# Altium project clock_for_filimonov.PrjPcb
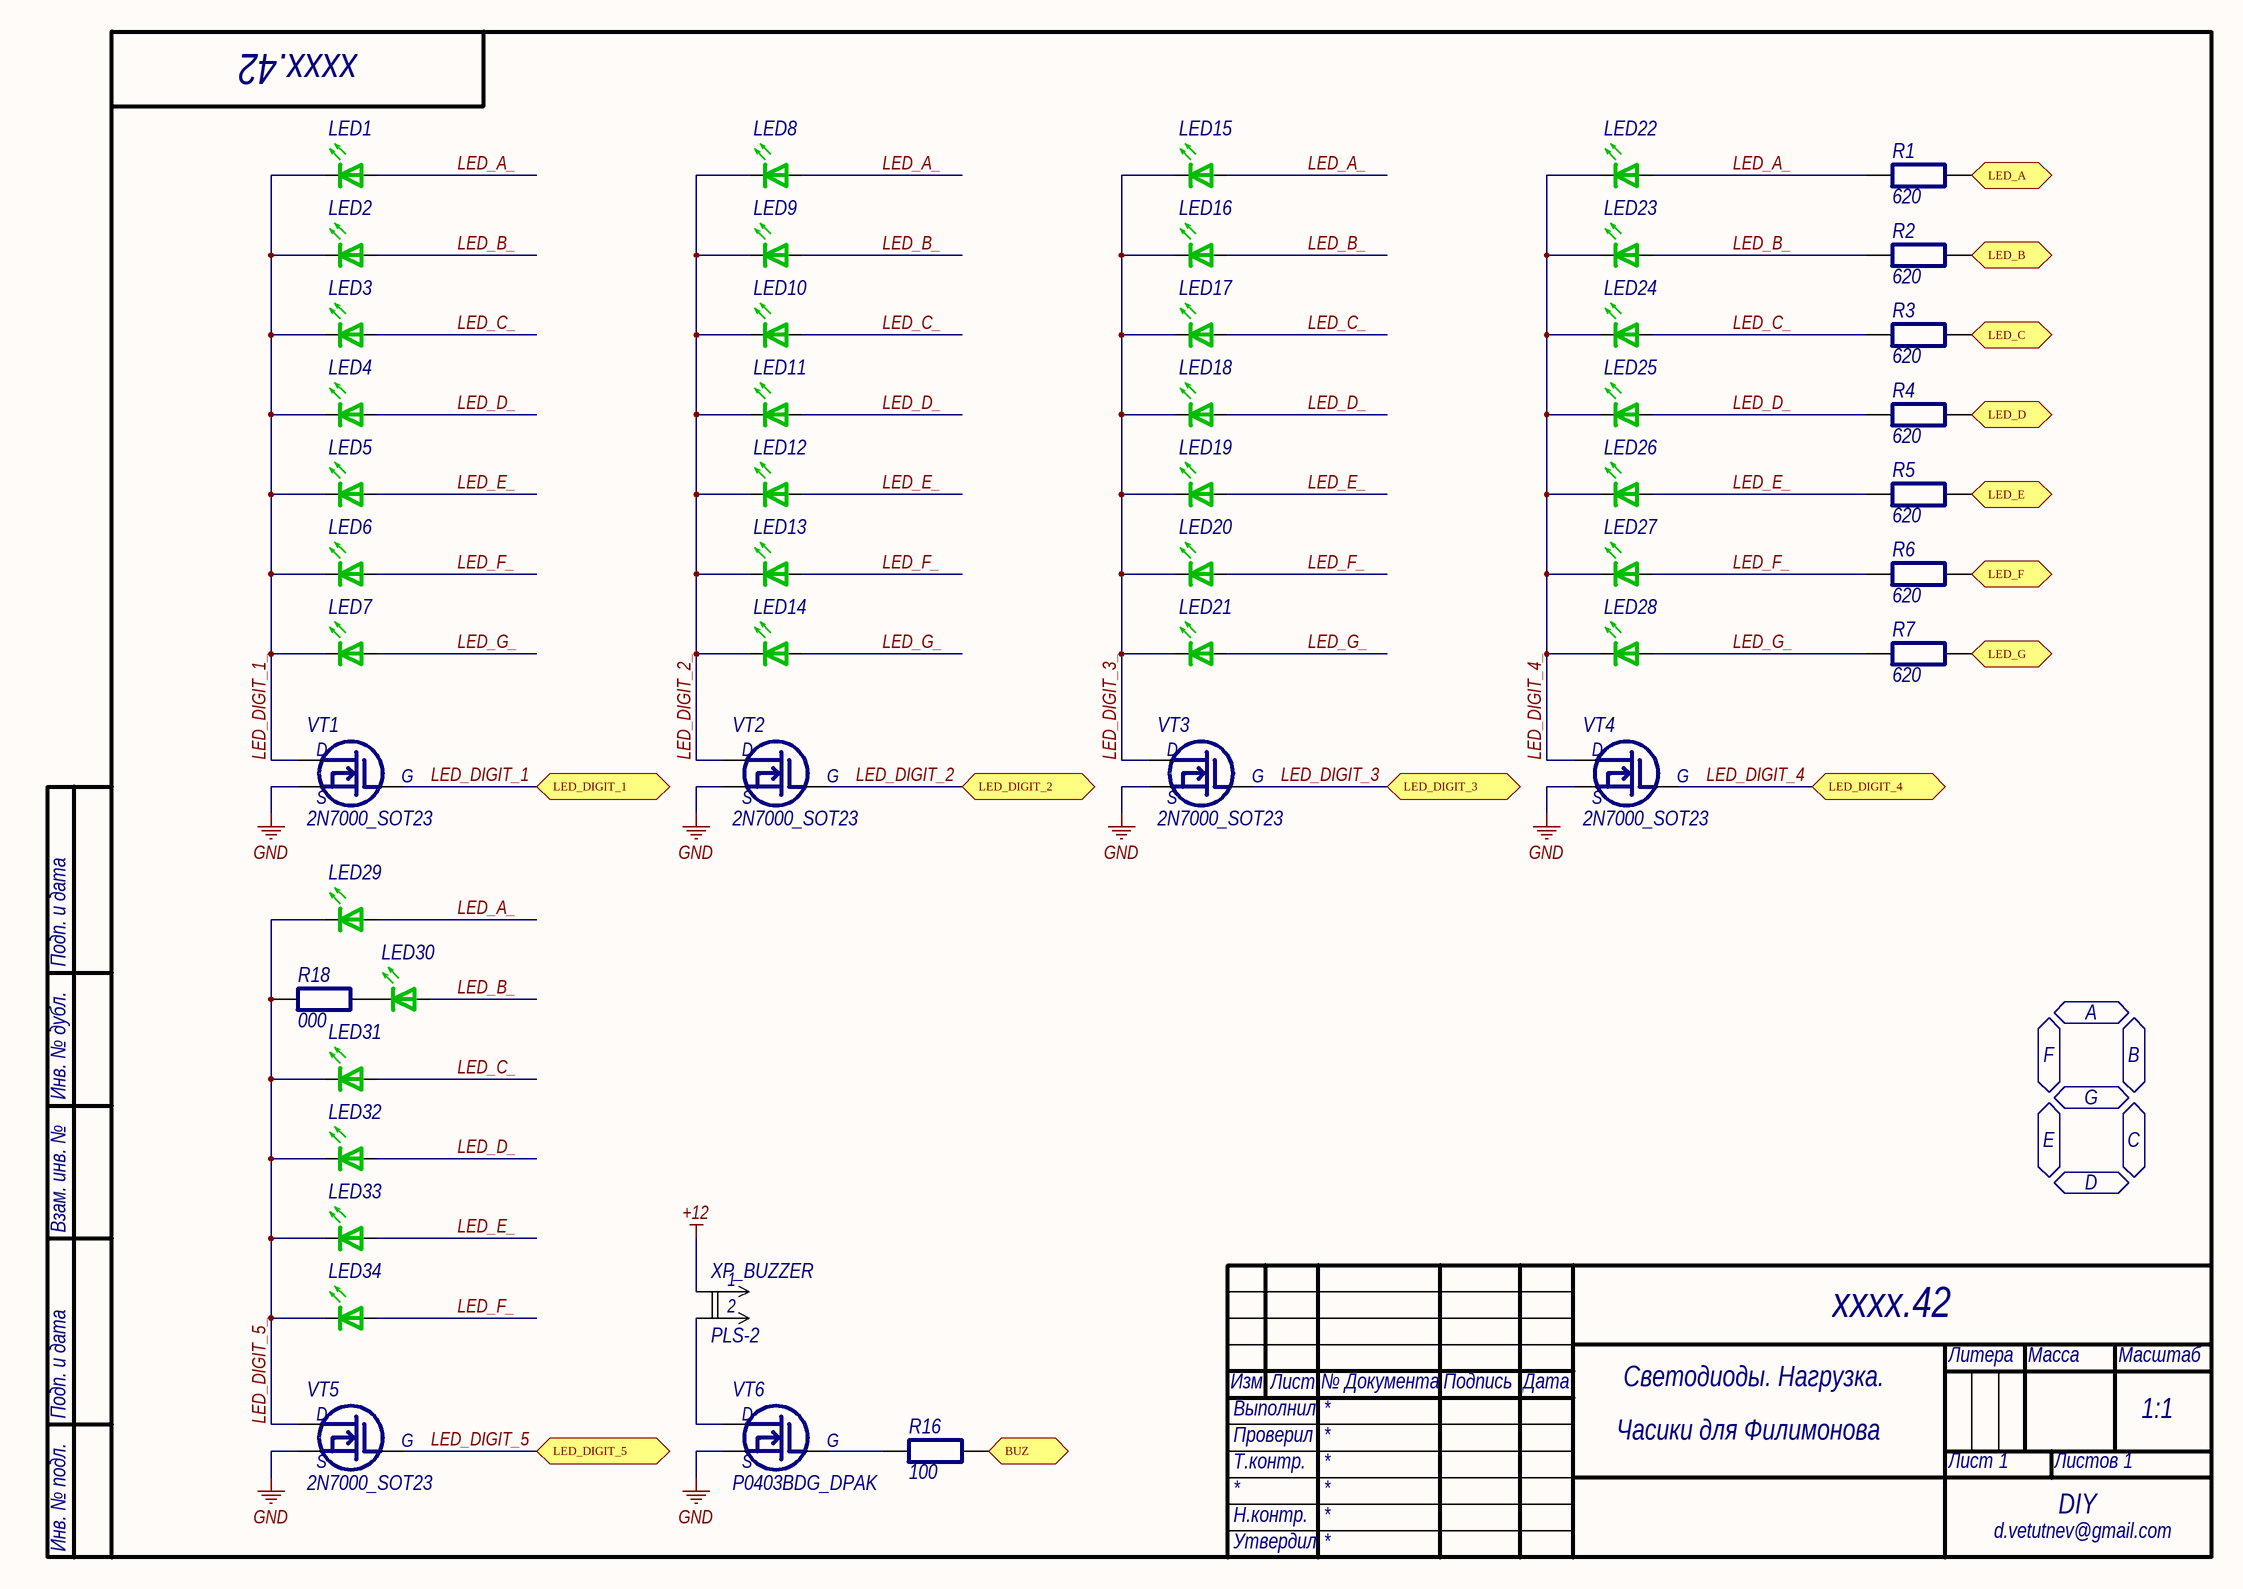
[diagram p0: LED.SchDoc]
Title2str: Часики для Филимонова
2 sheets, 77 parts. Net scope: flat (ports and power ports of the same name join across sheets).
Board file: PCB.PcbDoc
Sheets:
  LED.SchDoc
  PSU.SchDoc

## Sheet LED.SchDoc: Светодиоды. Нагрузка.
size 420 x 297 mm; Organization: DIY; Address1: L3, 12a Rodborough Rd; Address2: Frenchs Forest; Address3: NSW; Address4: Australia 2086; SheetNumber: 1; SheetTotal: 1; PageSetup: Record=PageOptions|CenterHorizontal=False|CenterVertical=False|PrintScale=1.00|XCorrection=1.00|YCorrection=1.00|PrintKind=2|BorderSize=5000000|LeftOffset=0|BottomOffset=0|Orientation=1|PaperLength=1000|PaperWidth=1000|Scale=100|PaperSource=7|PrintQuality=-4|MediaType=1|DitherType=10|PrintScaleMode=0|PaperKind=A4|PaperIndex=9; Document: Схема блока; Title2str: Часики для Филимонова; FirstReference: xxxx.42; Scale: 1:1; Email: d.vetutnev@gmail.com; ProjectName: УСТРОЙСТВО

### Parts
LED1  Green 0805  [CD2012-0805 - Green]  (value not drawn)
LED2  Green 0805  [CD2012-0805 - Green]  (value not drawn)
LED3  Green 0805  [CD2012-0805 - Green]  (value not drawn)
LED4  Green 0805  [CD2012-0805 - Green]  (value not drawn)
LED5  Green 0805  [CD2012-0805 - Green]  (value not drawn)
LED6  Green 0805  [CD2012-0805 - Green]  (value not drawn)
LED7  Green 0805  [CD2012-0805 - Green]  (value not drawn)
LED8  Green 0805  [CD2012-0805 - Green]  (value not drawn)
LED9  Green 0805  [CD2012-0805 - Green]  (value not drawn)
LED10  Green 0805  [CD2012-0805 - Green]  (value not drawn)
LED11  Green 0805  [CD2012-0805 - Green]  (value not drawn)
LED12  Green 0805  [CD2012-0805 - Green]  (value not drawn)
LED13  Green 0805  [CD2012-0805 - Green]  (value not drawn)
LED14  Green 0805  [CD2012-0805 - Green]  (value not drawn)
LED15  Green 0805  [CD2012-0805 - Green]  (value not drawn)
LED16  Green 0805  [CD2012-0805 - Green]  (value not drawn)
LED17  Green 0805  [CD2012-0805 - Green]  (value not drawn)
LED18  Green 0805  [CD2012-0805 - Green]  (value not drawn)
LED19  Green 0805  [CD2012-0805 - Green]  (value not drawn)
LED20  Green 0805  [CD2012-0805 - Green]  (value not drawn)
LED21  Green 0805  [CD2012-0805 - Green]  (value not drawn)
LED22  Green 0805  [CD2012-0805 - Green]  (value not drawn)
LED23  Green 0805  [CD2012-0805 - Green]  (value not drawn)
LED24  Green 0805  [CD2012-0805 - Green]  (value not drawn)
LED25  Green 0805  [CD2012-0805 - Green]  (value not drawn)
LED26  Green 0805  [CD2012-0805 - Green]  (value not drawn)
LED27  Green 0805  [CD2012-0805 - Green]  (value not drawn)
LED28  Green 0805  [CD2012-0805 - Green]  (value not drawn)
LED29  Green 0805  [CD2012-0805 - Green]  (value not drawn)
LED30  Green 0805  [CD2012-0805 - Green]  (value not drawn)
LED31  Green 0805  [CD2012-0805 - Green]  (value not drawn)
LED32  Green 0805  [CD2012-0805 - Green]  (value not drawn)
LED33  Green 0805  [CD2012-0805 - Green]  (value not drawn)
LED34  Green 0805  [CD2012-0805 - Green]  (value not drawn)
R1  620  [RESC2012M]
R2  620  [RESC2012M]
R3  620  [RESC2012M]
R4  620  [RESC2012M]
R5  620  [RESC2012M]
R6  620  [RESC2012M]
R7  620  [RESC2012M]
R16  100  [RESC2012M]
R18  000  [RESC3216M]
VT1  2N7000_SOT23  [SOT23]
VT2  2N7000_SOT23  [SOT23]
VT3  2N7000_SOT23  [SOT23]
VT4  2N7000_SOT23  [SOT23]
VT5  2N7000_SOT23  [SOT23]
VT6  P0403BDG_DPAK  [DPAK(TO252)]
XP_BUZZER  PLS-2  [PLS-2]

### Ports
BUZ, LED_A, LED_B, LED_C, LED_D, LED_DIGIT_1, LED_DIGIT_2, LED_DIGIT_3, LED_DIGIT_4, LED_DIGIT_5, LED_E, LED_F, LED_G

### Nets
+12: XP_BUZZER.1
GND: VT1.2(S) VT2.2(S) VT3.2(S) VT4.2(S) VT5.2(S) VT6.3(S)
BUZ: R16.2 ; port BUZ
LED_A: R1.2 ; port LED_A
LED_A_: LED1.1 LED8.1 LED15.1 LED22.1 LED29.1 R1.1
LED_B: R2.2 ; port LED_B
LED_B_: LED2.1 LED9.1 LED16.1 LED23.1 LED30.1 R2.1
LED_C: R3.2 ; port LED_C
LED_C_: LED3.1 LED10.1 LED17.1 LED24.1 LED31.1 R3.1
LED_D: R4.2 ; port LED_D
LED_D_: LED4.1 LED11.1 LED18.1 LED25.1 LED32.1 R4.1
LED_DIGIT_1: VT1.1(G) ; port LED_DIGIT_1
LED_DIGIT_1_: LED1.2 LED2.2 LED3.2 LED4.2 LED5.2 LED6.2 LED7.2 VT1.3(D)
LED_DIGIT_2: VT2.1(G) ; port LED_DIGIT_2
LED_DIGIT_2_: LED8.2 LED9.2 LED10.2 LED11.2 LED12.2 LED13.2 LED14.2 VT2.3(D)
LED_DIGIT_3: VT3.1(G) ; port LED_DIGIT_3  [project net ISP_MISO]
LED_DIGIT_3_: LED15.2 LED16.2 LED17.2 LED18.2 LED19.2 LED20.2 LED21.2 VT3.3(D)
LED_DIGIT_4: VT4.1(G) ; port LED_DIGIT_4  [project net ISP_MOSI]
LED_DIGIT_4_: LED22.2 LED23.2 LED24.2 LED25.2 LED26.2 LED27.2 LED28.2 VT4.3(D)
LED_DIGIT_5: VT5.1(G) ; port LED_DIGIT_5
LED_DIGIT_5_: LED29.2 LED31.2 LED32.2 LED33.2 LED34.2 R18.1 VT5.3(D)
LED_E: R5.2 ; port LED_E
LED_E_: LED5.1 LED12.1 LED19.1 LED26.1 LED33.1 R5.1
LED_F: R6.2 ; port LED_F
LED_F_: LED6.1 LED13.1 LED20.1 LED27.1 LED34.1 R6.1
LED_G: R7.2 ; port LED_G
LED_G_: LED7.1 LED14.1 LED21.1 LED28.1 R7.1
NetLED30_2: LED30.2 R18.2
NetR16_1: R16.1 VT6.1(G)
NetVT6_4: VT6.4(D) XP_BUZZER.2

### Notes on the sheet
- F
- A
- B
- E
- G
- C
- D
- Подп. и дата
- Инв. № дубл.
- Взам. инв. №
- Изм
- Выполнил
- Лист
- № Документа
- Подпись
- Дата
- Литера
- Масса
- Масштаб
- Проверил
- Т.контр.
- Листов
- Н.контр.
- Утвердил
- Инв. № подл.

### Library data of the parts
LED1-LED34 = LED_Green_0805: PartNumber: Green 0805
R1-R7 R16 = Res_0805: PartNumber: SMD 0805
  R1-R7: Value: 620
  R16: Value: 100
R18 = Res_1206: PartNumber: SMD 1206; Value: 000
VT1-VT5 = 2N7000_SOT23: PartNumber: 2N7000_SOT23
VT6 = P0403BDG_DPAK: PartNumber: P0403BDG_DPAK
XP_BUZZER = PLS-2: PartNumber: PLS-2

## Sheet PSU.SchDoc: МК. БП.
size 420 x 297 mm; Organization: DIY; Address1: L3, 12a Rodborough Rd; Address2: Frenchs Forest; Address3: NSW; Address4: Australia 2086; SheetNumber: 1; SheetTotal: 1; PageSetup: Record=PageOptions|CenterHorizontal=False|CenterVertical=False|PrintScale=1.00|XCorrection=1.00|YCorrection=1.00|PrintKind=2|BorderSize=5000000|LeftOffset=0|BottomOffset=0|Orientation=1|PaperLength=1000|PaperWidth=1000|Scale=100|PaperSource=7|PrintQuality=-4|MediaType=1|DitherType=10|PrintScaleMode=0|PaperKind=A4|PaperIndex=9; Document: Схема блока; Title2str: Часики для Филимонова; FirstReference: xxxx.42; Scale: 1:1; Email: d.vetutnev@gmail.com; ProjectName: УСТРОЙСТВО
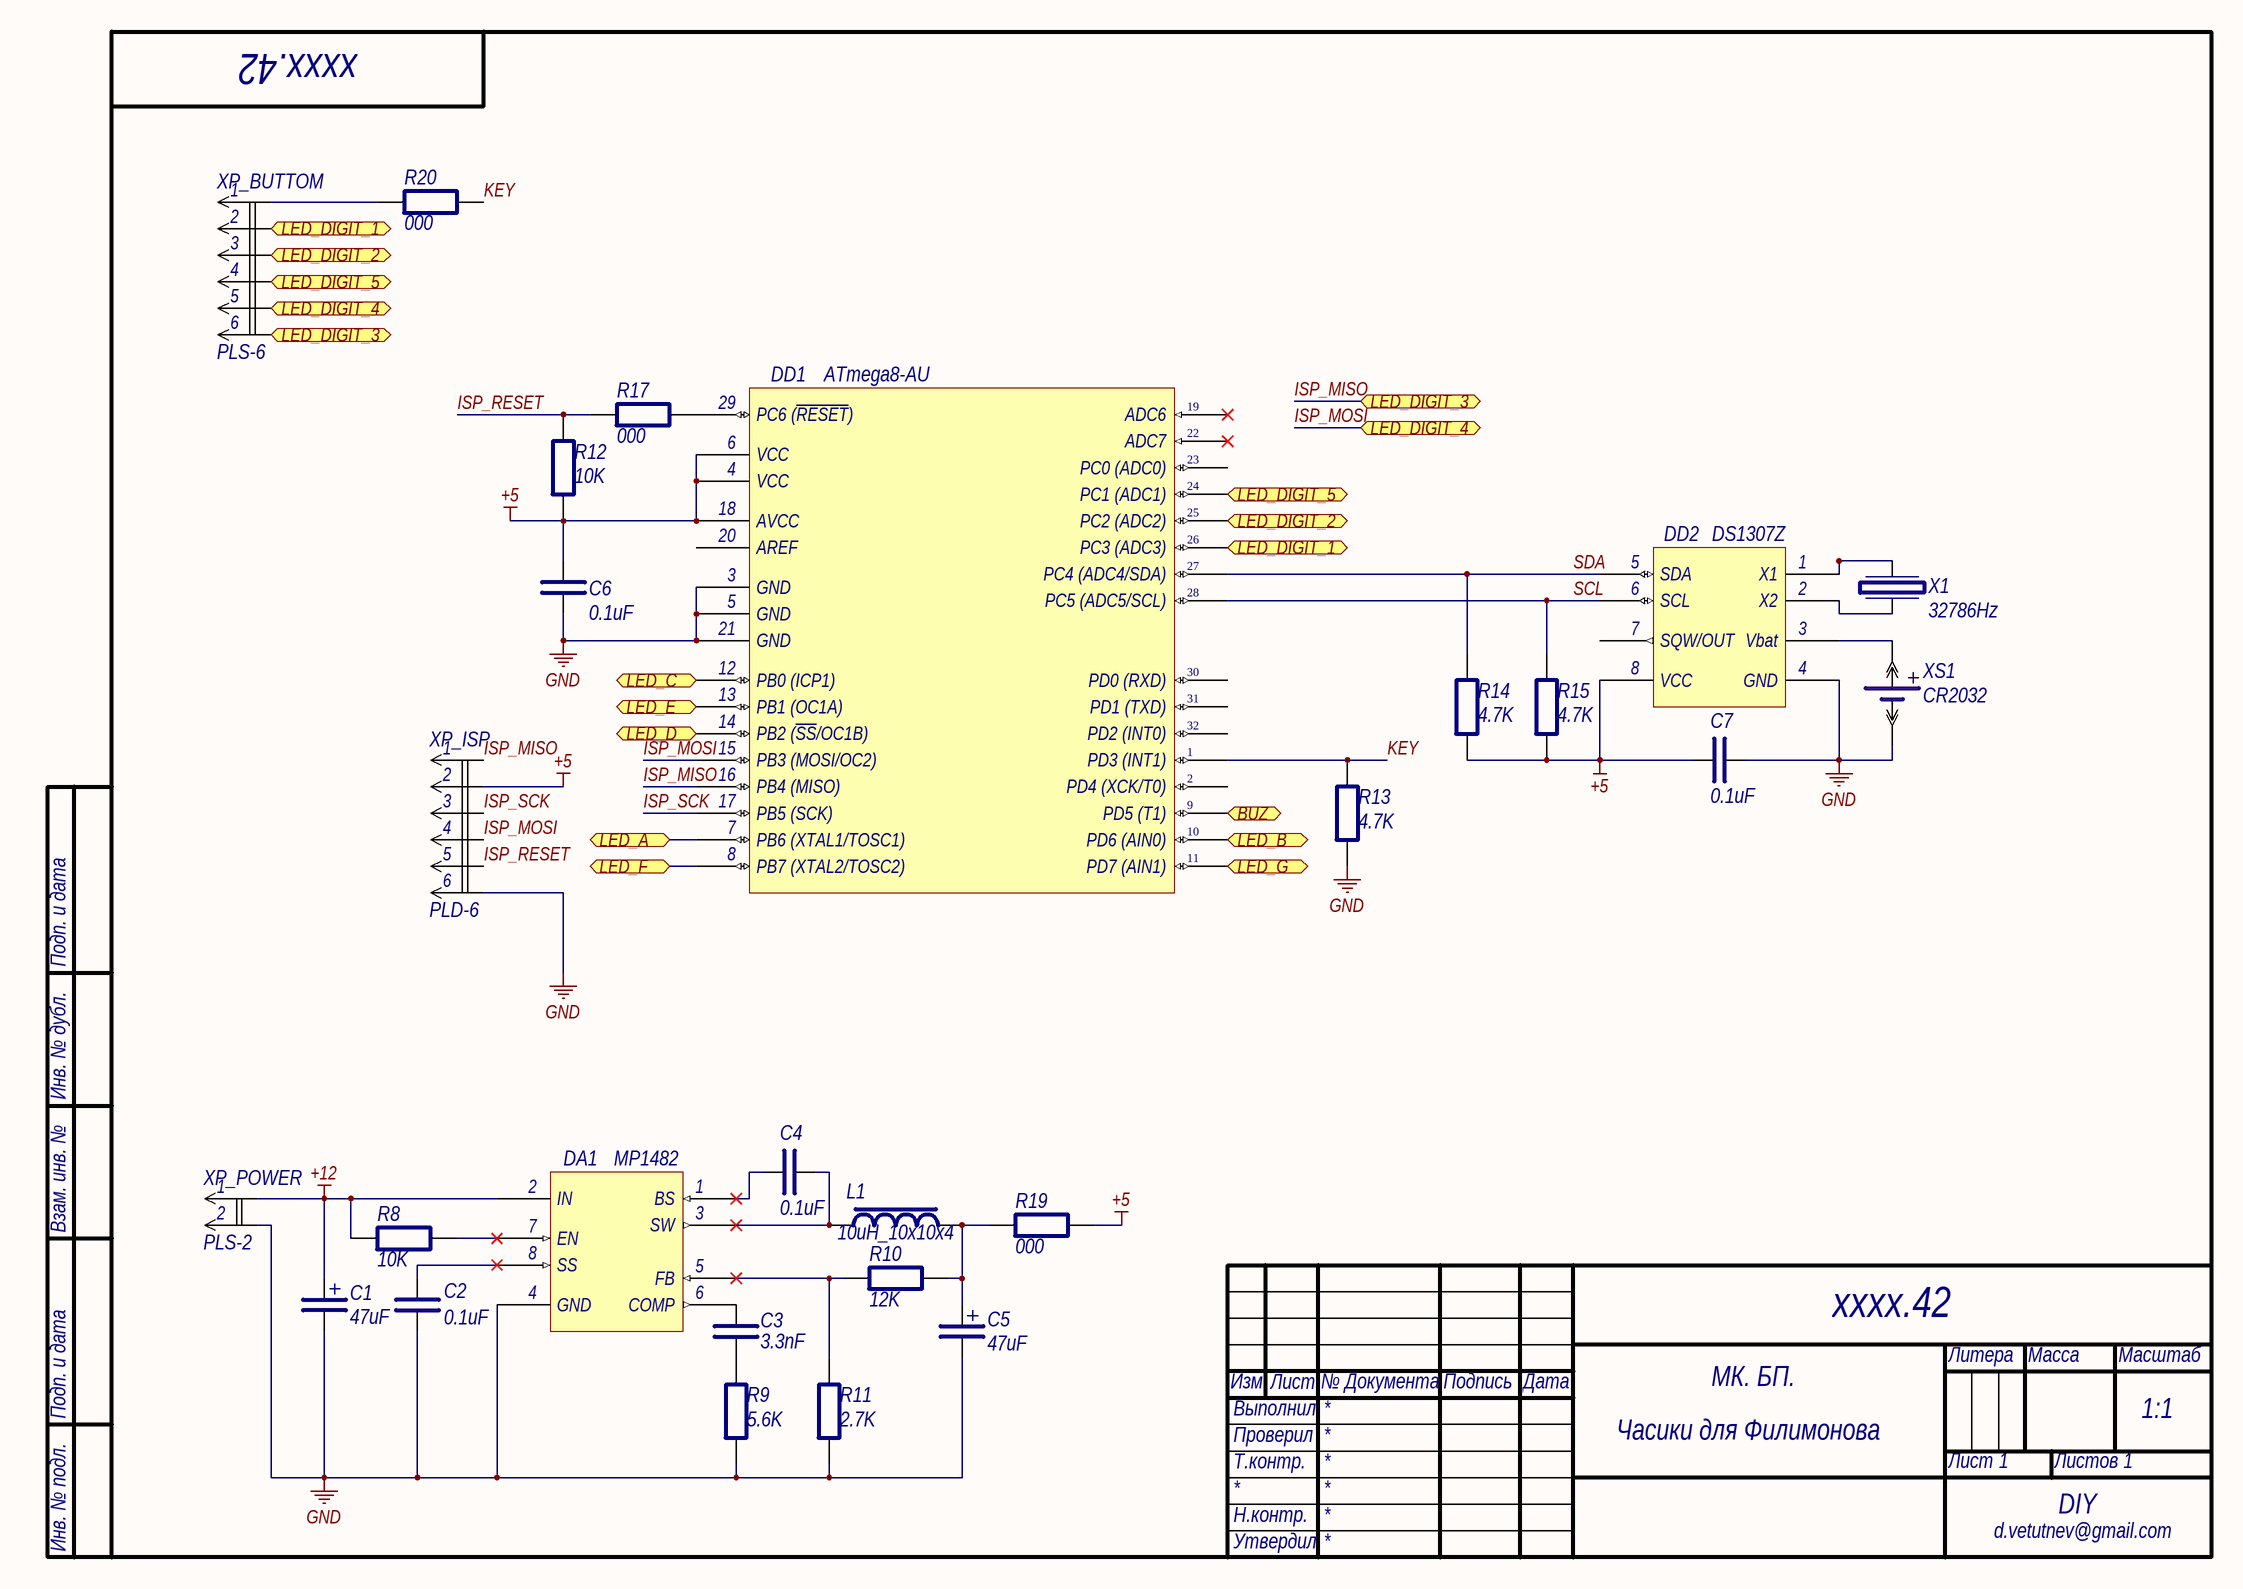
[diagram p1: PSU.SchDoc]

### Parts
C1  47uF  [TC7343-2917]
C2  0.1uF  [CAPC2012M]
C3  3.3nF  [CAPC2012M]
C4  0.1uF  [CAPC2012M]
C5  47uF  [TC7343-2917]
C6  0.1uF  [CAPC2012M]
C7  0.1uF  [CAPC2012M]
DA1  MP1482  [MP1482-SO8_M]
DD1  ATmega8-AU  [ATmega8-TQFP32]
DD2  DS1307Z  [DS1307-SO8_M]
L1  10uH_10x10x4  [10uH_10x10x4]
R8  10K  [RESC2012M]
R9  5.6K  [RESC2012M]
R10  12K  [RESC2012M]
R11  2.7K  [RESC2012M]
R12  10K  [RESC2012M]
R13  4.7K  [RESC2012M]
R14  4.7K  [RESC2012M]
R15  4.7K  [RESC2012M]
R17  000  [RESC3216M]
R19  000  [RESC3216M]
R20  000  [RESC3216M]
X1  32786Hz  [DT-38]
XP_BUTTOM  PLS-6  [PLS-6]
XP_ISP  PLD-6  [PLD-6]
XP_POWER  PLS-2  [PLS-2]
XS1  CR2032  [CR2032_holder_vert]

### Ports
BUZ, LED_A, LED_B, LED_C, LED_D, LED_DIGIT_1, LED_DIGIT_2, LED_DIGIT_3, LED_DIGIT_4, LED_DIGIT_5, LED_E, LED_F, LED_G

### Nets
+5: C6.2 C7.1 DD1.4(VCC) DD1.6(VCC) DD1.18(AVCC) DD2.8(VCC) R12.2 R14.1 R15.1 R19.2 XP_ISP.2
+12: C1.1 DA1.2(IN) R8.1 XP_POWER.1
GND: C1.2 C2.2 C5.2 C6.1 C7.2 DA1.4(GND) DD1.3(GND) DD1.5(GND) DD1.21(GND) DD2.4(GND) R9.1 R11.2 R13.1 XP_ISP.6 XP_POWER.2 XS1.2(-)
BUZ: DD1.9(PD5_(T1)) ; port BUZ
ISP_MISO: DD1.16(PB4_(MISO)) XP_BUTTOM.6 XP_ISP.1 ; port LED_DIGIT_3
ISP_MOSI: DD1.15(PB3_(MOSI/OC2)) XP_BUTTOM.5 XP_ISP.4 ; port LED_DIGIT_4
ISP_RESET: R12.1 R17.1 XP_ISP.5
ISP_SCK: DD1.17(PB5_(SCK)) XP_ISP.3
KEY: DD1.1(PD3_(INT1)) R13.2 R20.2
LED_A: DD1.7(PB6_(XTAL1/TOSC1)) ; port LED_A
LED_B: DD1.10(PD6_(AIN0)) ; port LED_B
LED_C: DD1.12(PB0_(ICP1)) ; port LED_C
LED_D: DD1.14(PB2_(~{SS}/OC1B)) ; port LED_D
LED_DIGIT_1: DD1.26(PC3_(ADC3)) XP_BUTTOM.2 ; port LED_DIGIT_1
LED_DIGIT_2: DD1.25(PC2_(ADC2)) XP_BUTTOM.3 ; port LED_DIGIT_2
LED_DIGIT_5: DD1.24(PC1_(ADC1)) XP_BUTTOM.4 ; port LED_DIGIT_5
LED_E: DD1.13(PB1_(OC1A)) ; port LED_E
LED_F: DD1.8(PB7_(XTAL2/TOSC2)) ; port LED_F
LED_G: DD1.11(PD7_(AIN1)) ; port LED_G
SCL: DD1.28(PC5_(ADC5/SCL)) DD2.6(SCL) R15.2
SDA: DD1.27(PC4_(ADC4/SDA)) DD2.5(SDA) R14.2
NetC2_1: C2.1 DA1.8(SS)
NetC3_1: C3.1 DA1.6(COMP)
NetC3_2: C3.2 R9.2
NetC4_1: C4.1 DA1.1(BS)
NetC4_2: C4.2 DA1.3(SW) L1.1
NetC5_1: C5.1 L1.2 R10.1 R19.1
NetDA1_5: DA1.5(FB) R10.2 R11.1
NetDA1_7: DA1.7(EN) R8.2
NetDD1_29: DD1.29(PC6_(~{RESET})) R17.2
NetDD2_1: DD2.1(X1) X1.2
NetDD2_2: DD2.2(X2) X1.1
NetDD2_3: DD2.3(Vbat) XS1.1(+)
NetR20_1: R20.1 XP_BUTTOM.1

Not connected (* = marked no-connect by the designer): DD1 2(PD4_(XCK/T0)) 19(ADC6)* 20(AREF) 22(ADC7)* 23(PC0_(ADC0)) 30(PD0_(RXD)) 31(PD1_(TXD)) 32(PD2_(INT0)); DD2 7(SQW/OUT)

### Notes on the sheet
- Подп. и дата
- Инв. № дубл.
- Взам. инв. №
- Изм
- Выполнил
- Лист
- № Документа
- Подпись
- Дата
- Литера
- Масса
- Масштаб
- Проверил
- Т.контр.
- Листов
- Н.контр.
- Утвердил
- Инв. № подл.

### Library data of the parts
C1 C5 = Cap_Tant_D: PartNumber: Case D; Value: 47uF
C2-C4 C6 C7 = Cap_0805: PartNumber: SMD 0805
  C2 C4 C6 C7: Value: 0.1uF
  C3: Value: 3.3nF
R8-R15 = Res_0805: PartNumber: SMD 0805
  R8 R12: Value: 10K
  R9: Value: 5.6K
  R10: Value: 12K
  R11: Value: 2.7K
  R13-R15: Value: 4.7K
R17 R19 R20 = Res_1206: PartNumber: SMD 1206; Value: 000
X1 = DT-38: PartNumber: DT-38; Value: 32786Hz
XS1 = CR2032_Holder_vert: PartNumber: CR2032
DA1 = MP1482: PartNumber: *
DD1 = ATmega8-AU: PartNumber: *
DD2 = DS1307Z: PartNumber: *
L1 = 10uH_10x10x4: PartNumber: 10uH_10x10x4
XP_BUTTOM = PLS-6: PartNumber: PLS-6
XP_ISP = PLD-6: PartNumber: PLD-6
XP_POWER = PLS-2: PartNumber: PLS-2

## Nets that join several sheets
+12: LED (XP_BUZZER.1), PSU (C1.1 DA1.2 R8.1 XP_POWER.1)
GND: LED (6 pins), PSU (16 pins)
BUZ: LED (R16.2), PSU (DD1.9)
ISP_MISO: LED (VT3.1), PSU (DD1.16 XP_BUTTOM.6 XP_ISP.1)
ISP_MOSI: LED (VT4.1), PSU (DD1.15 XP_BUTTOM.5 XP_ISP.4)
LED_A: LED (R1.2), PSU (DD1.7)
LED_B: LED (R2.2), PSU (DD1.10)
LED_C: LED (R3.2), PSU (DD1.12)
LED_D: LED (R4.2), PSU (DD1.14)
LED_DIGIT_1: LED (VT1.1), PSU (DD1.26 XP_BUTTOM.2)
LED_DIGIT_2: LED (VT2.1), PSU (DD1.25 XP_BUTTOM.3)
LED_DIGIT_5: LED (VT5.1), PSU (DD1.24 XP_BUTTOM.4)
LED_E: LED (R5.2), PSU (DD1.13)
LED_F: LED (R6.2), PSU (DD1.8)
LED_G: LED (R7.2), PSU (DD1.11)